# EAGLE schematic schematic (EAGLE 7.3.0)
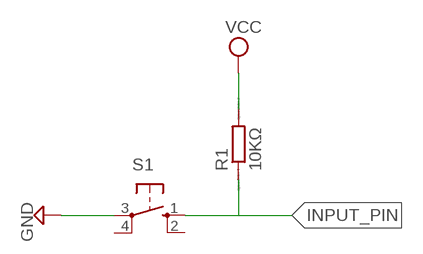
[diagram p0: schematic, sheet 1]

## Parts
R1  10KΩ  R0207/10  [0207/10]
S1  10-XX  [B3F-10XX]

## Nets
GND: S1.3(P)
INPUT_PIN: R1.1 S1.1(S)
VCC: R1.2
Unconnected: S1.2(S1) S1.4(P1)

## Library data of the parts
R1 = eagle-ltspice:R: RESISTOR, European symbol; SPICEMODEL: NONE; SPICEPREFIX: R
S1 = switch-omron:10-XX: OMRON SWITCH; MPN: B3F-1000; OC_FARNELL: 176432; OC_NEWARK: 36M3542